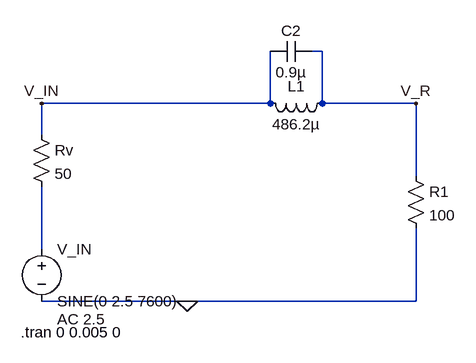
[diagram p0: schematic Notchdefinitivo.asc]
Notchdefinitivo.asc, the LTspice schematic file:
Version 4.1
SHEET 1 880 680
WIRE 352 128 336 128
WIRE 272 208 272 128
WIRE 272 208 -80 208
WIRE 352 208 352 128
WIRE 496 208 352 208
WIRE -80 256 -80 208
WIRE 496 320 496 208
WIRE -80 432 -80 336
WIRE 144 512 -80 512
WIRE 496 512 496 400
WIRE 496 512 144 512
FLAG 144 512 0
FLAG -80 208 V_IN
FLAG 496 208 V_R
SYMBOL voltage -80 416 R0
WINDOW 123 24 124 Left 2
WINDOW 39 0 0 Left 0
SYMATTR Value2 AC 2.5
SYMATTR InstName V_IN
SYMATTR Value SINE(0 2.5 7600)
SYMBOL cap 336 112 R90
WINDOW 0 0 32 VBottom 2
WINDOW 3 32 32 VTop 2
SYMATTR InstName C2
SYMATTR Value 0.9µ
SYMBOL ind 368 192 R90
WINDOW 0 5 56 VBottom 2
WINDOW 3 32 56 VTop 2
SYMATTR InstName L1
SYMATTR Value 486.2µ
SYMATTR SpiceLine Rser=2.5
SYMBOL res 480 304 R0
SYMATTR InstName R1
SYMATTR Value 100
SYMBOL res -96 240 R0
SYMATTR InstName Rv
SYMATTR Value 50
TEXT -112 560 Left 2 !.tran 0 0.005 0

The netlist it stands for:
* Notchdefinitivo.asc
V_IN N001 0 SINE(0 2.5 7600) AC 2.5
C2 V_R V_IN 0.9µ
L1 V_R V_IN 486.2µ Rser=2.5
R1 V_R 0 100
Rv V_IN N001 50
.tran 0 0.005 0
.backanno
.end